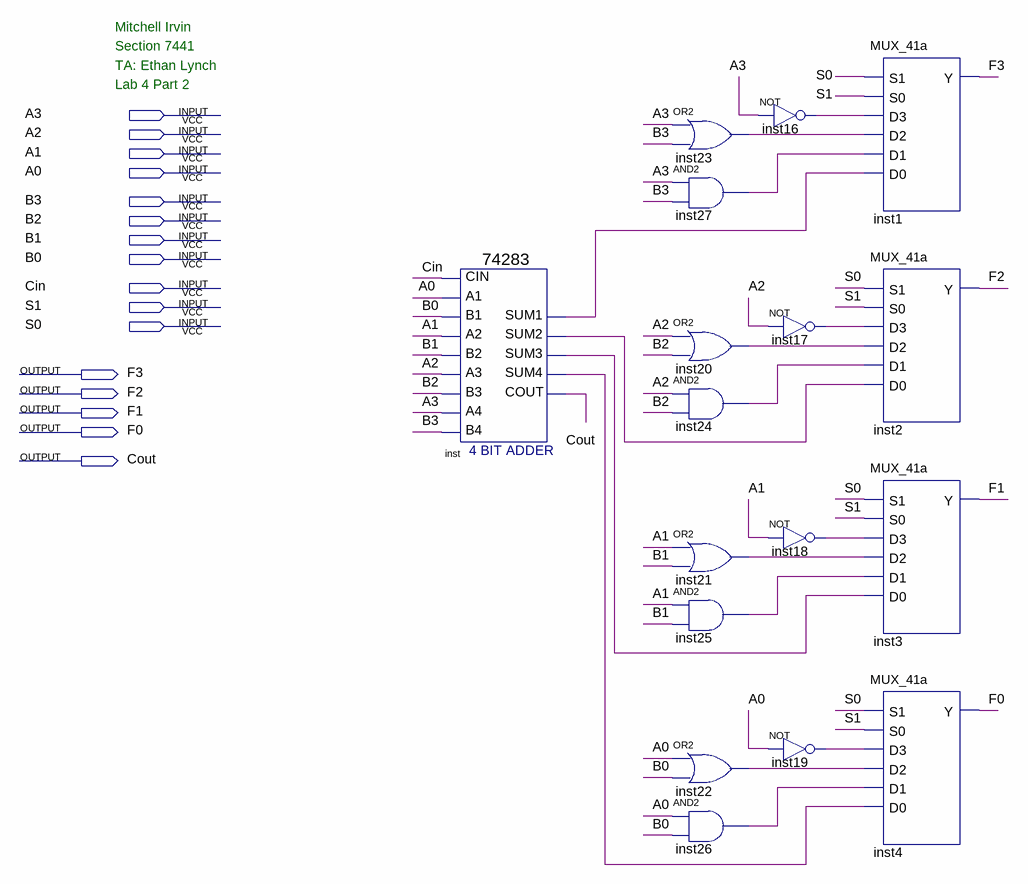
[diagram p0: schematic sheet]
// Quartus schematic lab4part2.bdf as structural Verilog: 17 symbols, 16 pins
module lab4part2 (
  input  A3,
  input  A2,
  input  A1,
  input  A0,
  input  B3,
  input  B2,
  input  B1,
  input  B0,
  input  Cin,
  input  S1,
  input  S0,
  output F3,
  output F2,
  output F1,
  output F0,
  output Cout
);

  wire inst16_out, inst17_out, inst18_out, inst19_out, inst20_out, inst21_out, inst22_out, inst23_out,
       inst24_out, inst25_out, inst26_out, inst27_out, inst_sum1, inst_sum2, inst_sum3, inst_sum4;

  \74283  inst (
    .CIN(Cin), .A1(A0), .A2(A1), .B2(B1), .A3(A2), .A4(A3), .B4(B3), .B1(B0), .B3(B2), .SUM4(inst_sum4),
    .COUT(Cout), .SUM1(inst_sum1), .SUM2(inst_sum2), .SUM3(inst_sum3));
  or inst23 (inst23_out, A3, B3);
  and inst27 (inst27_out, A3, B3);
  or inst20 (inst20_out, A2, B2);
  and inst24 (inst24_out, A2, B2);
  or inst21 (inst21_out, A1, B1);
  and inst25 (inst25_out, A1, B1);
  or inst22 (inst22_out, A0, B0);
  and inst26 (inst26_out, A0, B0);
  not inst16 (inst16_out, A3);
  not inst17 (inst17_out, A2);
  not inst18 (inst18_out, A1);
  not inst19 (inst19_out, A0);
  MUX_41a inst1 (.S1(S0), .S0(S1), .D3(inst16_out), .D2(inst23_out), .D1(inst27_out), .D0(inst_sum1), .Y(F3));
  MUX_41a inst2 (.S1(S0), .S0(S1), .D3(inst17_out), .D2(inst20_out), .D1(inst24_out), .D0(inst_sum2), .Y(F2));
  MUX_41a inst3 (.S1(S0), .S0(S1), .D3(inst18_out), .D2(inst21_out), .D1(inst25_out), .D0(inst_sum3), .Y(F1));
  MUX_41a inst4 (.S1(S0), .S0(S1), .D3(inst19_out), .D2(inst22_out), .D1(inst26_out), .D0(inst_sum4), .Y(F0));

  // Notes on the sheet:
  //   Mitchell Irvin
  //   Section 7441
  //   TA: Ethan Lynch
  //   Lab 4 Part 2
endmodule
